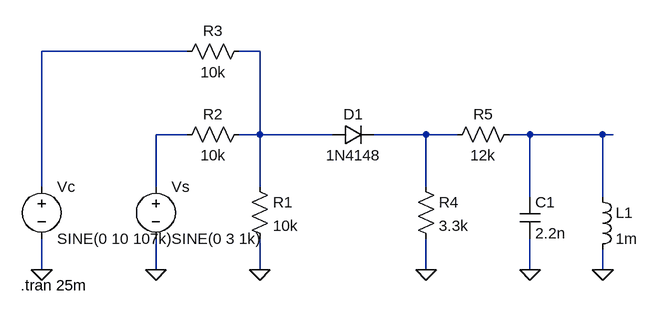
[diagram p0: schematic ex7_modulador.asc]
ex7_modulador.asc, the LTspice schematic file:
Version 4
SHEET 1 880 680
WIRE 32 144 -192 144
WIRE 144 144 112 144
WIRE 32 272 -16 272
WIRE 144 272 144 144
WIRE 144 272 112 272
WIRE 256 272 144 272
WIRE 400 272 320 272
WIRE 448 272 400 272
WIRE 560 272 528 272
WIRE 672 272 560 272
WIRE 688 272 672 272
WIRE -192 352 -192 144
WIRE -16 352 -16 272
WIRE 144 352 144 272
WIRE 400 352 400 272
WIRE 560 368 560 272
WIRE 672 368 672 272
WIRE -192 480 -192 432
WIRE -16 480 -16 432
WIRE 144 480 144 432
WIRE 400 480 400 432
WIRE 560 480 560 432
WIRE 672 480 672 448
FLAG -192 480 0
FLAG -16 480 0
FLAG 144 480 0
FLAG 400 480 0
FLAG 560 480 0
FLAG 672 480 0
SYMBOL voltage -192 336 R0
SYMATTR InstName Vc
SYMATTR Value SINE(0 10 107k)
SYMBOL voltage -16 336 R0
SYMATTR InstName Vs
SYMATTR Value SINE(0 3 1k)
SYMBOL res 128 336 R0
SYMATTR InstName R1
SYMATTR Value 10k
SYMBOL res 128 256 R90
WINDOW 0 0 56 VBottom 2
WINDOW 3 32 56 VTop 2
SYMATTR InstName R2
SYMATTR Value 10k
SYMBOL res 128 128 R90
WINDOW 0 0 56 VBottom 2
WINDOW 3 32 56 VTop 2
SYMATTR InstName R3
SYMATTR Value 10k
SYMBOL res 384 336 R0
SYMATTR InstName R4
SYMATTR Value 3.3k
SYMBOL res 544 256 R90
WINDOW 0 0 56 VBottom 2
WINDOW 3 32 56 VTop 2
SYMATTR InstName R5
SYMATTR Value 12k
SYMBOL cap 544 368 R0
SYMATTR InstName C1
SYMATTR Value 2.2n
SYMBOL ind 656 352 R0
SYMATTR InstName L1
SYMATTR Value 1m
SYMBOL diode 256 288 R270
WINDOW 0 32 32 VTop 2
WINDOW 3 0 32 VBottom 2
SYMATTR InstName D1
SYMATTR Value 1N4148
TEXT -224 504 Left 2 !.tran 25m

The netlist it stands for:
* ex7_modulador.asc
Vc N001 0 SINE(0 10 107k)
Vs N003 0 SINE(0 3 1k)
R1 N002 0 10k
R2 N002 N003 10k
R3 N002 N001 10k
R4 N004 0 3.3k
R5 N005 N004 12k
C1 N005 0 2.2n
L1 N005 0 1m
D1 N002 N004 1N4148
.model D D
.lib standard.dio
.tran 25m
.backanno
.end